# Altium schematic sheet pots.SchDoc: Scalony Skaner Bioimpedancji
size A4; DrawnBy: Łukasz Przeniosło; Organization: Zachodniopomorski; Address1: Uniwersytet Technologiczny; Address2: w Szczecinie; Address3: Wydział Elektryczny; Address4: Katedra KISSE; Revision: 1.0; SheetNumber: 6; SheetTotal: 7
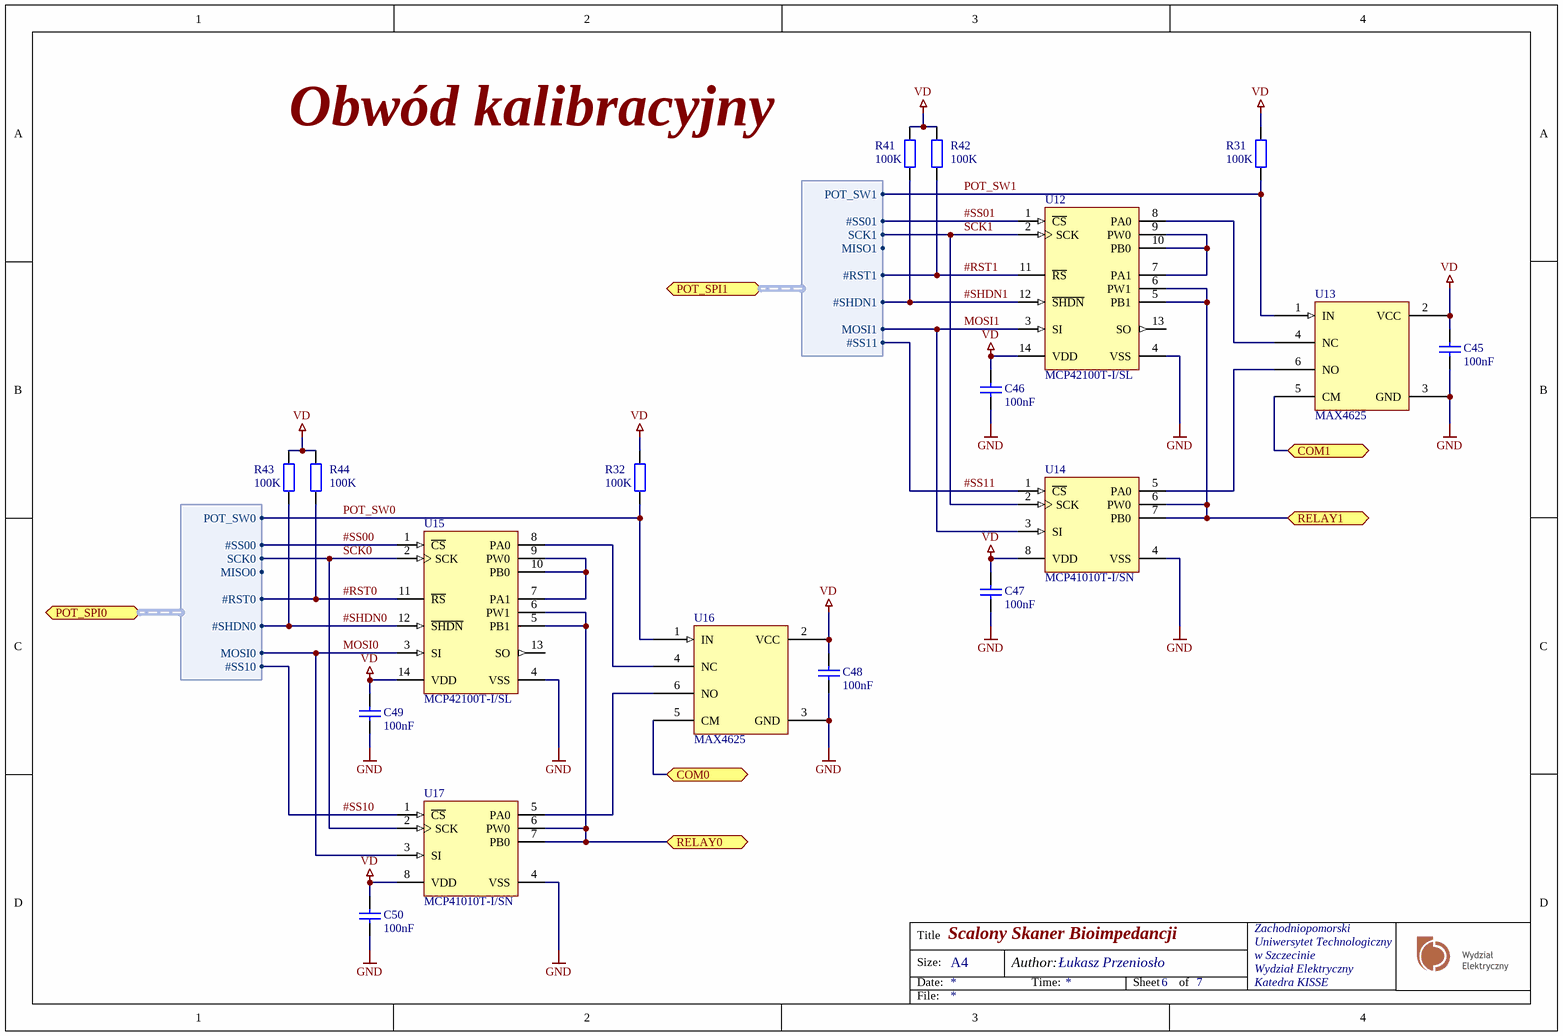
[diagram p0: pots.SchDoc]

## Parts
C45  100nF  [CAPC1608N]
C46  100nF  [CAPC1608N]
C47  100nF  [CAPC1608N]
C48  100nF  [CAPC1608N]
C49  100nF  [CAPC1608N]
C50  100nF  [CAPC1608N]
R31  100K  [RESC1608N]
R32  100K  [RESC1608N]
R41  100K  [RESC1608N]
R42  100K  [RESC1608N]
R43  100K  [RESC1608N]
R44  100K  [RESC1608N]
U12  MCP42100T-I/SL  [ADI-R-14_N]
U13  MAX4625  [SOT100P275-6L]
U14  MCP41010T-I/SN  [SOIC127P600-8AL]
U15  MCP42100T-I/SL  [ADI-R-14_N]
U16  MAX4625  [SOT100P275-6L]
U17  MCP41010T-I/SN  [SOIC127P600-8AL]

## Ports
COM0, COM1, POT_SPI0 (harness POT_SPI0), POT_SPI1 (harness POT_SPI1), RELAY0, RELAY1

## Harnesses
POT_SPI0: MISO0, MOSI0, SCK0, #SS00, #SS10, #RST0, #SHDN0, POT_SW0
POT_SPI1: MISO1, MOSI1, SCK1, #SS01, #SS11, #RST1, #SHDN1, POT_SW1

## Nets
GND: C45.1 C46.1 C47.1 C48.1 C49.1 C50.1 U12.4(VSS) U13.3(GND) U14.4(VSS) U15.4(VSS) U16.3(GND) U17.4(VSS)
VD: C45.2 C46.2 C47.2 C48.2 C49.2 C50.2 R31.2 R32.2 R41.2 R42.2 R43.2 R44.2 U12.14(VDD) U13.2(VCC) U14.8(VDD) U15.14(VDD) U16.2(VCC) U17.8(VDD)
#RST0: R44.1 U15.11(~{RS}) ; port POT_SPI0.#RST0
#RST1: R42.1 U12.11(~{RS}) ; port POT_SPI1.#RST1
#SHDN0: R43.1 U15.12(~{SHDN}) ; port POT_SPI0.#SHDN0
#SHDN1: R41.1 U12.12(~{SHDN}) ; port POT_SPI1.#SHDN1
#SS00: U15.1(~{CS}) ; port POT_SPI0.#SS00
#SS01: U12.1(~{CS}) ; port POT_SPI1.#SS01
#SS10: U17.1(~{CS}) ; port POT_SPI0.#SS10
#SS11: U14.1(~{CS}) ; port POT_SPI1.#SS11
COM0: U16.5(CM) ; port COM0
COM1: U13.5(CM) ; port COM1
MOSI0: U15.3(SI) U17.3(SI) ; port POT_SPI0.MOSI0
MOSI1: U12.3(SI) U14.3(SI) ; port POT_SPI1.MOSI1
POT_SW0: R32.1 U16.1(IN) ; port POT_SPI0.POT_SW0
POT_SW1: R31.1 U13.1(IN) ; port POT_SPI1.POT_SW1
RELAY0: U15.5(PB1) U15.6(PW1) U17.6(PW0) U17.7(PB0) ; port RELAY0
RELAY1: U12.5(PB1) U12.6(PW1) U14.6(PW0) U14.7(PB0) ; port RELAY1
SCK0: U15.2(SCK) U17.2(SCK) ; port POT_SPI0.SCK0
SCK1: U12.2(SCK) U14.2(SCK) ; port POT_SPI1.SCK1
NetU12_7: U12.7(PA1) U12.9(PW0) U12.10(PB0)
NetU12_8: U12.8(PA0) U13.4(NC)
NetU13_6: U13.6(NO) U14.5(PA0)
NetU15_7: U15.7(PA1) U15.9(PW0) U15.10(PB0)
NetU15_8: U15.8(PA0) U16.4(NC)
NetU16_6: U16.6(NO) U17.5(PA0)

Not connected (* = marked no-connect by the designer): U12 13(SO); U15 13(SO)

## Notes on the sheet
- Obwód kalibracyjny
- Title
- Size:
- Date:
- A4
- Author:
- Time:
- Sheet
- of
- File:

## Library data of the parts
C45-C50 = Capacitor: Value: 100nF
R31 R32 R41-R44 = Resistor: Power: 0W; Tolerance: 5%; Value: 100K
U12 U15 = CMP-0188-00459-2: Single/Dual Digital Potentiometer with SPI Interface, 14-Pin SOIC 150mil, Industrial Temperature, Tape and Reel; RevisionNote: URLs added.; ComponentLink3URL: http://www.microchip.com/stellent/groups/techpub_sg/documents/packagingspec/en012702.pdf; Code_JEDEC: MS-012-AB; ComponentLink2Description: Datasheet; ComponentLink1Description: Manufacturer URL; ComponentLink1URL: http://www.microchip.com/; ComponentLink2URL: http://ww1.microchip.com/downloads/en/DeviceDoc/11195c.pdf; DatasheetVersion: Jul-2003; PackageVersion: revBB, Aug-2009; PackageDescription: 14-Lead Plastic Small Outline (SL) - Narrow, 3.90mm Body [SOIC]; ComponentLink3Description: Package Specification; PackageReference: SOIC-SL14; Code_IPC: SOIC127P600-14
U14 U17 = CMP-0188-00466-2: Single/Dual Digital Potentiometer with SPI Interface, 8-Pin SOIC 150mil, Industrial Temperature, Tape and Reel; ComponentLink2URL: http://ww1.microchip.com/downloads/en/DeviceDoc/11195c.pdf; PackageReference: SOIC-SN8; PackageDescription: 8-Lead Plastic Small Outline (SN) - Narrow, 3.90mm Body [SOIC]; ComponentLink3URL: http://www.microchip.com/stellent/groups/techpub_sg/documents/packagingspec/en012702.pdf; ComponentLink2Description: Datasheet; Code_JEDEC: MS-012; ComponentLink1URL: http://www.microchip.com/; PackageVersion: revBB, Aug-2009; DatasheetVersion: Jul-2003; ComponentLink1Description: Manufacturer URL; ComponentLink3Description: Package Specification; Code_IPC: SOIC127P600-8; RevisionNote: URLs added.